# Altium schematic sheet subckt_adc_TLC2574.SchDoc
size B; SheetNumber: 5; SheetTotal: 5
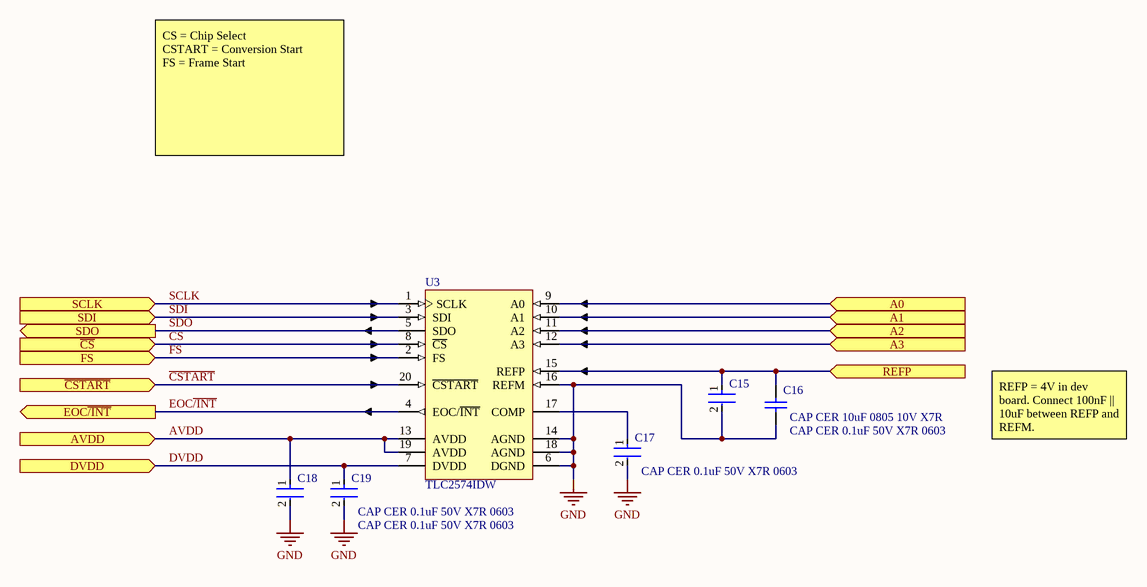
[diagram p0: subckt_adc_TLC2574.SchDoc]

## Parts
C15  CAP CER 0.1uF 50V X7R 0603  [FP-CC0603-DA-MFG]
C16  CAP CER 10uF 0805 10V X7R  [CAPC2013X140X50NL20T25]
C17  CAP CER 0.1uF 50V X7R 0603  [FP-CC0603-DA-MFG]
C18  CAP CER 0.1uF 50V X7R 0603  [FP-CC0603-DA-MFG]
C19  CAP CER 0.1uF 50V X7R 0603  [FP-CC0603-DA-MFG]
U3  TLC2574IDW  [TI-DW20_L]

## Ports
A0 (in), A1 (in), A2 (in), A3 (in), AVDD (in), DVDD (in), EOC~{/INT} (out), FS (in), REFP (in), SCLK (in), SDI (in), SDO (out), ~{CSTART} (in), ~{CS} (in)

## Nets
GND: C15.2 C16.2 C17.2 C18.2 C19.2 U3.6(DGND) U3.14(AGND) U3.16(REFM) U3.18(AGND)
~{CS}: U3.8(~{CS}) ; port ~{CS}
~{CSTART}: U3.20(~{CSTART}) ; port ~{CSTART}
A0: U3.9(A0) ; port A0
A1: U3.10(A1) ; port A1
A2: U3.11(A2) ; port A2
A3: U3.12(A3) ; port A3
AVDD: C18.1 U3.13(AVDD) U3.19(AVDD) ; port AVDD
DVDD: C19.1 U3.7(DVDD) ; port DVDD
EOC~{/INT}: U3.4(EOC/~{INT}) ; port EOC~{/INT}
FS: U3.2(FS) ; port FS
REFP: C15.1 C16.1 U3.15(REFP) ; port REFP
SCLK: U3.1(SCLK) ; port SCLK
SDI: U3.3(SDI) ; port SDI
SDO: U3.5(SDO) ; port SDO
NetC17_1: C17.1 U3.17(COMP)

## Notes on the sheet
- CS = Chip Select
  CSTART = Conversion Start
  FS = Frame Start
- REFP = 4V in dev board. Connect 100nF || 10uF between REFP and REFM.

## Library data of the parts
C15 C17-C19 = CMP-03422-000030-1: Manufacturer Part Number: CC0603KRX7R7BB104; Manufacturer: YAGEO; Voltage Rating: 16 V; Tolerance: 0.1; Value: 100 nF; Temperature Coefficient: 15%; Material: Ceramic; Package: CC0603-DA; ComponentLink2Description: Datasheet; Octopart: https://octopart.com/cc0603krx7r7bb104-yageo-192941; Temperature Range High: +125°C; Digikey Description: CAP CER 0.1UF 16V X7R 0603; Voltage: 16 V; Device Class L2: Capacitors; Height: 0.9mm; Temperature: -55°C to +125°C; Device Class L1: Passive Components; Device Class L3: Ceramic Capacitors; ComponentLink2URL: http://www.yageo.com/documents/recent/UPY-GPHC_X7R_6.3V-to-50V_18.pdf; Footprint Url: http://www.yageo.com/exep/pages/download/literatures/UPY-C_GEN_24.pdf; RoHS: TRUE; Temperature Range Low: -55°C; Temperature Characteristic: X7R; Lead Free: Yes; Capacitance: 100 nF; Category: Cap; Mouser Description: Multilayer Ceramic Capacitor, CC Series, 0.1 - F, - 10%, X7R, 16 V, 0603 [1608 Metric]; Automotive: No
C16 = CMP-2007-04677-1: Part Number: 0805ZC475KAT2A; Manufacturer: AVX Interconnect / Elco
U3 = CMP-0003-01500-1: Serial Out, Low Power with Built-In Conversion Clock and 8 x FIFO, 4 Channel, -40 to 85 degC, 20-pin SOIC (DW20), Green (RoHS & no Sb/Br); Manufacturer: Texas Instruments; Resolution(Bits): 12; SubFamily: Precision ADC (<=10MSPS); Interface: Serial SPI; ENOB(Bits): 11.7; # Input Channels: 4; Analog Voltage AV/DD(Min)(V): 4.75; Digital Supply(Min)(V): 2.7; Analog Voltage AV/DD(Max)(V): 5.5; INL(Max)(+/-LSB): 1; Sample Rate (max)(SPS): 200K; Architecture: SAR; SINAD(dB): 72; SFDR(dB): 83; ComponentLink3Description: Package Specification; Mounting Technology: Surface Mount; ComponentLink1URL: http://www.ti.com/; ComponentLink3URL: http://www.ti.com/lit/ml/mpds173a/mpds173a.pdf; PartNumber: TLC2574IDW; ComponentLink2Description: Datasheet; PackageReference: DW20; Eco-Plan: Green (RoHS & no Sb/Br); ComponentLink2URL: http://www.ti.com/general/docs/lit/getliterature.tsp?genericPartNumber=TLC2574&fileType=pdf; PackageDescription: 20-Pin Plastic Small Outline, Body 12.8 x 7.5 mm, Pitch 1.27 mm; Code_JEDEC: MO-013; PackageVersion: 4040000-4/G, 01/2011; ComponentLink1Description: Manufacturer URL; Digital Supply(Max)(V): 5.5; SNR(dB): 72; DatasheetVersion: SLAS262C